# Altium project FAT75.PrjPCB
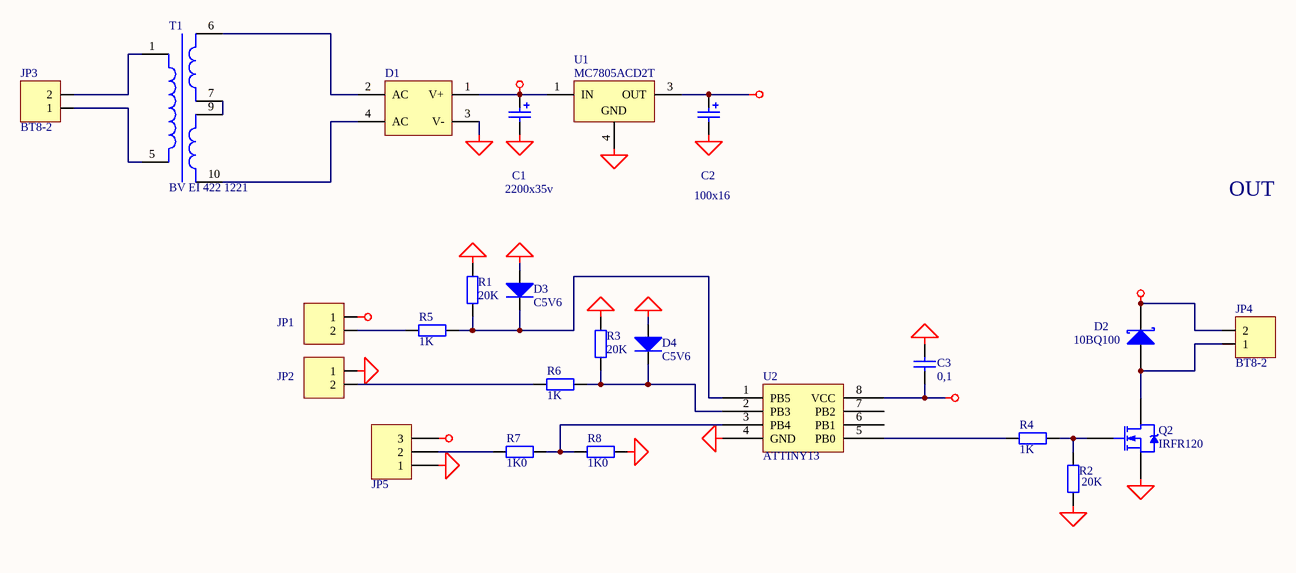
[diagram p0: main.SCHDOC]
1 sheet, 24 parts. Net scope: global (net labels, ports and power ports of the same name join across sheets).
Board file: main.PcbDoc

## Sheet main.SCHDOC
size A4

### Parts
C1  value 2200x35v  [el8_L]
C2  100x16  [el3_L]
C3  value 0,1  [_1206]  (hidden comment: Cap Semi)
D1  Bridge2  [KBU8M_L]  (value not drawn)
D2  10BQ100  [DSO-C2/X2.3]
D3  C5V6  [_1206d]
D4  C5V6  [_1206d]
JP1  BT5-2  [BT5-2_L]  (value not drawn)
JP2  BT5-2  [BT5-2_L]  (value not drawn)
JP3  BT8-2  [BT8-2_L]
JP4  BT8-2  [BT8-2_L]
JP5  Header 3  [BT5-3_L]  (value not drawn)
Q2  IRFR120  [SIP-G3]
R1  20K  [_1206]
R2  20K  [_1206]
R3  20K  [_1206]
R4  1K  [_1206]
R5  1K  [_1206]
R6  1K  [_1206]
R7  1K0  [_1206]
R8  1K0  [_1206]
T1  BV EI 422 1221  [BV EI 304 2840_L]
U1  MC7805ACD2T  [D2PAKTO220_L]
U2  ATTINY13  [DIP-8]

### Nets
+5v: C2.1 C3.2 JP5.3 U1.3(OUT) U2.8(VCC)
+24v: C1.1 D1.1(V+) D2.2(K) JP1.1 JP4.2 U1.1(IN)
GND: C1.2 C2.2 C3.1 D1.3(V-) D3.1(A) D4.1(A) JP2.1 JP5.1 Q2.3(S) R1.2 R2.2 R3.2 R8.1 U1.4(GND) U2.4(GND)
NetD1_2: D1.2(AC) T1.6(Sec1+)
NetD1_4: D1.4(AC) T1.10(Sec1-)
NetD2_1: D2.1(A) JP4.1 Q2.4(D)
NetD3_2: D3.2(K) R1.1 R5.2 U2.1(PB5)
NetD4_2: D4.2(K) R3.1 R6.2 U2.2(PB3)
NetJP1_2: JP1.2 R5.1
NetJP2_2: JP2.2 R6.1
NetJP3_1: JP3.1 T1.5(Pri-)
NetJP3_2: JP3.2 T1.1(Pri+)
NetJP5_2: JP5.2 R7.2
NetQ2_1: Q2.1(G) R2.1 R4.2
NetR4_1: R4.1 U2.5(PB0)
NetR7_1: R7.1 R8.2 U2.3(PB4)
NetT1_7: T1.7(Sec1-) T1.9(Sec1+)

Not connected (* = marked no-connect by the designer): U2 6(PB1) 7(PB2)

### Notes on the sheet
- OUT

### Library data of the parts
C1 = Cap Pol1: Polarized Capacitor (Radial); Manufacturer: Generic Components; Class I: Passive; Published: 8-Jun-2000; Revision: July-2002: Re-released for DXP Platform.; Publisher: Altium Limited; Class II: Capacitor
C2 = Cap Pol: Polarized Capacitor (Radial); Manufacturer: Generic Components; Class I: Passive; Published: 8-Jun-2000; Revision: July-2002: Re-released for DXP Platform.; Publisher: Altium Limited; Class II: Capacitor; Value: 100x16
C3 = Cap Semi: Capacitor (Semiconductor SIM Model); Manufacturer: Generic Components; Class I: Passive; Published: 8-Jun-2000; Revision: July-2002: Re-released for DXP Platform.; Publisher: Altium Limited; Class II: Capacitor
D1 = Bridge2: Diode Bridge; Manufacturer: Generic Components; Class I: Discrete; Class II: Rectifier - Bridge; Published: 24-Mar-1999; Revision: July-2002: Re-released for DXP Platform.; Publisher: Altium Limited
D2 = 10BQ015: Schottky Rectifier; Manufacturer: International Rectifier; Revision 1: 10-July-2000: SIM Model Added.; Revision 2: July-2002: Re-released for DXP Platform.; Class I: Discrete; Class II: Rectifier - Schottky; Published: 8-Jun-2000; Datasheet: Latest Revision: PD-2.396A; Package Reference: DO-214AA; Publisher: Altium Limited
D3 D4 = Diode: Default Diode; Manufacturer: Generic Components; Class I: Discrete; Class II: Diode - Switching; Published: 8-Jun-2000; Revision: July-2002: Re-released for DXP Platform.; Publisher: Altium Limited
JP1-JP4 = BT5-2: Header, 3-Pin; Manufacturer: Generic Components; Class I: Connector; Revision: July-2002: Re-released for DXP Platform.; Publisher: Altium Limited
JP5 = Header 3: Header, 3-Pin; Manufacturer: Generic Components; Class I: Connector; Revision: July-2002: Re-released for DXP Platform.; Publisher: Altium Limited
Q2 = IRFR120: HEXFET N-Channel Power MOSFET; Manufacturer: International Rectifier; Revision 1: 10-July-2000: SIM Model Added.; Revision 2: July-2002: Re-released for DXP Platform.; Class I: Discrete; Class II: MOSFET - Power; Note: Pin 2 is trimmed and is electrically connected to Drain.; Published: 8-Jun-2000; Datasheet: Latest Revision: PD-9.523D; Package Reference: TO-252AA; Publisher: Altium Limited
R1-R3 = Res2: Resistor; Manufacturer: Generic Components; Class I: Passive; Rule: Undefined; Published: 8-Jun-2000; Revision: July-2002: Re-released for DXP Platform.; Publisher: Altium Limited; Class II: Resistor; Value: 20K
R4-R6 = Res2: Resistor; Manufacturer: Generic Components; Class I: Passive; Value: 20K; Rule: Undefined; Published: 8-Jun-2000; Revision: July-2002: Re-released for DXP Platform.; Publisher: Altium Limited; Class II: Resistor
R7 R8 = Res2: Resistor; Manufacturer: Generic Components; Class I: Passive; Value: 1K; Published: 8-Jun-2000; Revision: July-2002: Re-released for DXP Platform.; Publisher: Altium Limited; Class II: Resistor
T1 = BV EI 422 1221: Manufacturer: Generic Components; Class I: Passive; Class II: Transformer; Published: 25-Jan-2001; Revision: July-2002: Re-released for DXP Platform.; Publisher: Altium Limited
U1 = MC7805ACD2T: Three-Terminal Positive Voltage Regulator; Manufacturer: ON Semiconductor; Package Information: Latest Revision: 1997; Class I: Power Management; Note: Pin 2 is electrically connected to Pin 4; Pin 2 is trimmed and not drawn;; Published: 15-Apr-2002; Datasheet: Latest Revision: 1997; Package Reference: 936-03; Publisher: Altium Limited; Class II: Voltage Regulator